# Altium schematic sheet LAMP.SchDoc
size A4; SheetNumber: 1; SheetTotal: 1
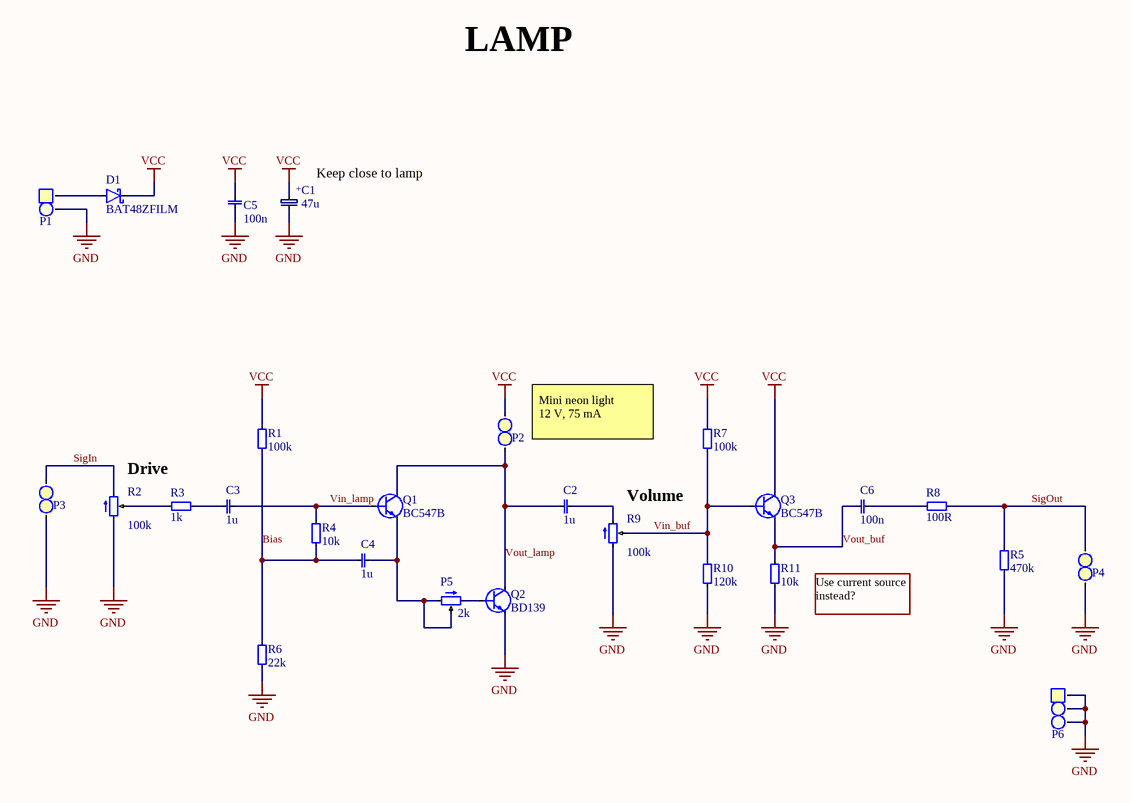
[diagram p0: LAMP.SchDoc]

## Parts
C1  value 47u  [Cap, SMD, Polar, 5.3x5.3mm]  (hidden comment: Capacitor, TH 2mm)
C2  value 1u  [0805, cap]  (hidden comment: 0805, capacitor)
C3  value 1u  [0805, cap]  (hidden comment: 0805, capacitor)
C4  value 1u  [0805, cap]  (hidden comment: 0805, capacitor)
C5  value 100n  [0805, cap]  (hidden comment: 0805, capacitor)
C6  value 100n  [0805, cap]  (hidden comment: 0805, capacitor)
D1  BAT48ZFILM  [SOD123]
P1  1x2 Pin Header  [padtwo_L]  (value not drawn)
P2  1x2 Pin Heade Straight  [padtwo_L]  (value not drawn)
P3  1x2 Pin Heade Straight  [padtwo_L]  (value not drawn)
P4  1x2 Pin Heade Straight  [padtwo_L]  (value not drawn)
P5  value 2k  [Pot_3362P]  (hidden comment: Pot)
P6  1x3 Pin Header  [padThree_L]  (value not drawn)
Q1  BC547B  [BC547_TO-92_BENT]
Q2  BD139  [TO-126 Angle]
Q3  BC547B  [BC547_TO-92_BENT]
R1  value 100k  [0805]  (hidden comment: General resistor)
R2  100k  [RK09L_15mm]
R3  value 1k  [0805]  (hidden comment: General resistor)
R4  value 10k  [0805]  (hidden comment: General resistor)
R5  value 470k  [0805]  (hidden comment: General resistor)
R6  value 22k  [0805]  (hidden comment: General resistor)
R7  value 100k  [0805]  (hidden comment: General resistor)
R8  value 100R  [0805]  (hidden comment: General resistor)
R9  100k  [RK09L_15mm]
R10  value 120k  [0805]  (hidden comment: General resistor)
R11  value 10k  [0805]  (hidden comment: General resistor)

## Nets
GND: C1.1 C5.2 P1.2 P3.2 P4.2 P6.1 P6.2 P6.3 Q2.1(E) R2.1 R5.0 R6.1 R9.1 R10.1 R11.1
VCC: C1.2 C5.1 D1.1(K) P2.1 Q3.1(C) R1.0 R7.0
Bias: C4.2 R1.1 R4.1 R6.0
SigIn: P3.1 R2.3
SigOut: P4.1 R5.1 R8.0
Vin_buf: Q3.2(B) R7.1 R9.2 R10.0
Vin_lamp: C3.1 Q1.2(B) R4.0
Vout_buf: C6.2 Q3.3(E) R11.0
Vout_lamp: C2.2 P2.2 Q1.1(C) Q2.2(C)
NetC2_1: C2.1 R9.3
NetC3_2: C3.2 R3.1
NetC4_1: C4.1 P5.1 P5.2 Q1.3(E)
NetC6_1: C6.1 R8.1
NetD1_2: D1.2(A) P1.1
NetP5_3: P5.3 Q2.3(B)
NetR2_2: R2.2 R3.0

## Notes on the sheet
- LAMP
- (near C1) Keep close to lamp
- (near P2) Mini neon light
  12 V, 75 mA
- Drive
- (near R9) Volume
- (near R11) Use current source instead?
- TITLE:
- REV:
- DOCUMENT:
- noxet
- DATE:
- (in symbol Capacitor, TH 2mm) +

## Library data of the parts
C1 = Capacitor, TH 2mm: Capacitor TH 2mm; Supplier: *; Order number: *
D1 = BAT48ZFILM: Rectifier Diode, Schottky, 1 Phase, 1 Element, 0.35A, 40V V(RRM), Silicon; Manufacturer: STMicroelectronics; Package Body Material: Plastic; Forward Voltage: 250mV; Non-rep Pk Forward Current-Max: 2A; Number of Elements: 1; Max Output current: 350mA; Time @ Peak Reflow Temperature-Max (s): 30s; Qualification Status: Not Qualified; Supplier: Rs; Supplier Part Number: 7146853P; Manufacturer Part Number: BAT48ZFILM; RoHS: Yes; Category: Rectifier Diodes; Stock: 13200; Pricing: 250=2,567, 500=2,311, 1250=2,081, 2500=1,976 (SEK); Pins: 2; Diode Element Material: SILICON; Package Shape: Rectangular; Terminal Finish: Tin; Max Operating Temperature: 150°C; JESD-609 Code: e3; Diode Type: RECTIFIER; JESD-30 Code: R-PDSO-G2; Package Style: SMALL OUTLINEMeter; Peak Reflow Temperature (Cel): 260°C; Rep Pk Reverse Voltage-Max: 40V; Surface Mount: Yes; Technology: SCHOTTKY; Terminal Form: Gull Wing; Terminal Position: DUAL; Reach SVHC Compliant: No; RoHS Compliant: Yes; ComponentLink1URL: https://datasheet.ciiva.com:443/pdfs/VipMasterIC/IC/SGST/SGSTS30425/SGSTS30425-1.pdf?src-supplier=IHS+Markit; ComponentLink1Description: https://datasheet.ciiva.com:443/pdfs/VipMasterIC/IC/SGST/SGSTS30425/SGSTS30425-1.pdf?src-supplier=IHS+Markit; ComponentLink2URL: https://datasheet.ciiva.com/16421/cd00130229-16421639.pdf?src-supplier=Future+Electronics; ComponentLink2Description: https://datasheet.ciiva.com/16421/cd00130229-16421639.pdf?src-supplier=Future+Electronics; ComponentLink3URL: https://datasheet.ciiva.com/915/cd00130229-915584.pdf?src-supplier=Digikey; ComponentLink3Description: https://datasheet.ciiva.com/915/cd00130229-915584.pdf?src-supplier=Digikey; ComponentLink4URL: https://datasheet.ciiva.com/915/cd00130229-915585.pdf?src-supplier=Digikey; ComponentLink4Description: https://datasheet.ciiva.com/915/cd00130229-915585.pdf?src-supplier=Digikey; ComponentLink5URL: https://datasheet.ciiva.com/915/cd00130229-915586.pdf?src-supplier=Digikey; ComponentLink5Description: https://datasheet.ciiva.com/915/cd00130229-915586.pdf?src-supplier=Digikey; ComponentLink6URL: https://datasheet.ciiva.com/4714/cd00130229-4714093.pdf?src-supplier=Mouser; ComponentLink6Description: https://datasheet.ciiva.com/4714/cd00130229-4714093.pdf?src-supplier=Mouser
P1 = 1x2 Pin Header: 2.54 mm, TH; Value: 1x2 Pin Header
P2-P4 = 1x2 Pin Heade Straight: 2.54 mm, TH; Value: 1x2 Pin Header
P6 = 1x3 Pin Header: 2.54 mm; Value: 1x3 Pin Header
Q1 Q3 = NPN CBE
Q2 = NPN ECB
R1 R3-R8 R10 R11 = resistor
R2 R9 = Potentiometer: Value: 0; ELFA: 300-08-353